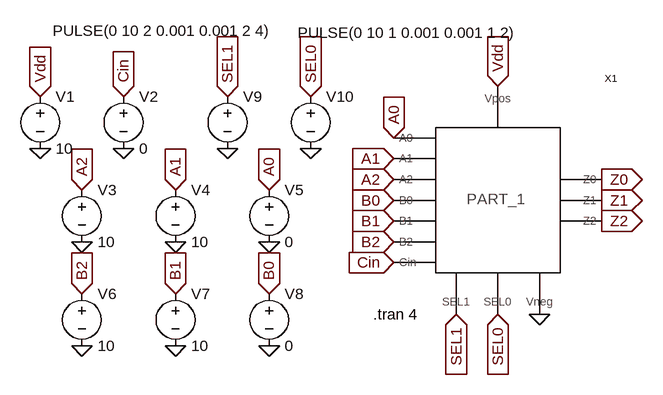
[diagram p0: schematic PART_1_SYM_TESTING.asc]
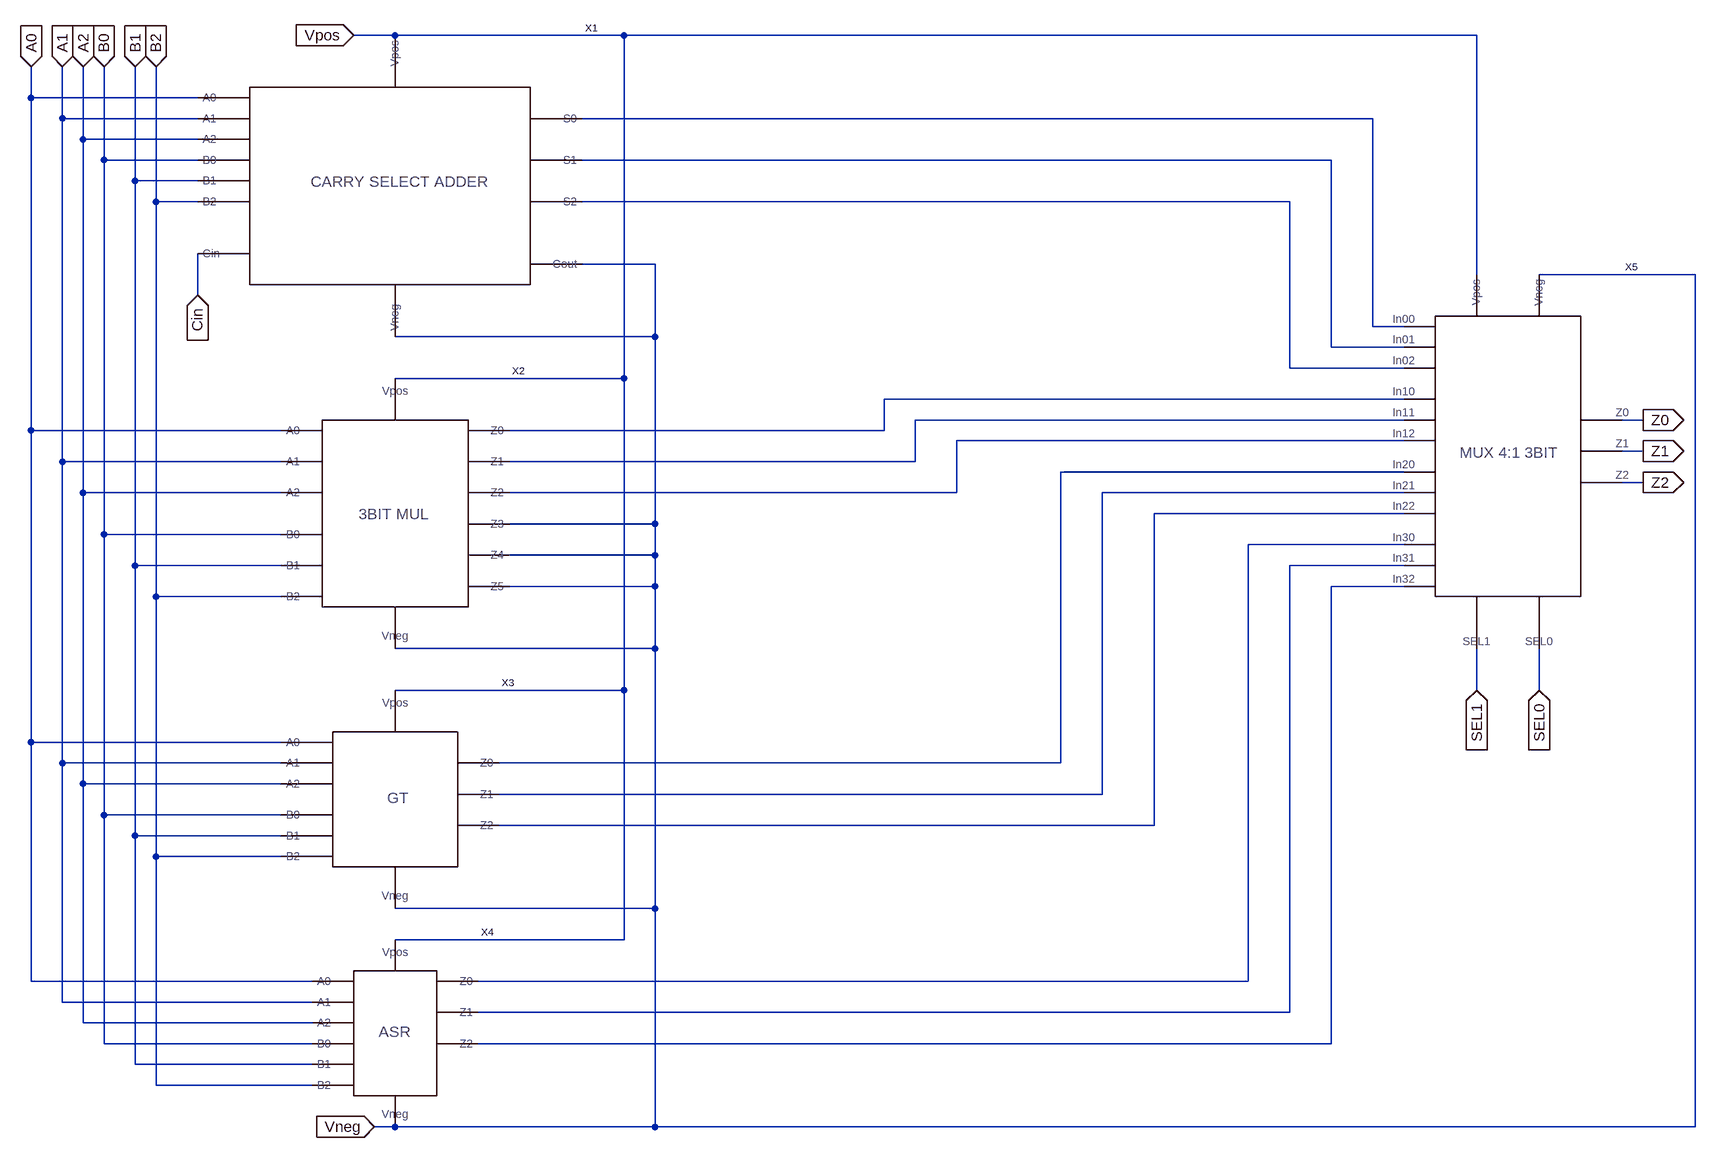
[diagram p1: sub-circuit part_1_sym.asc]
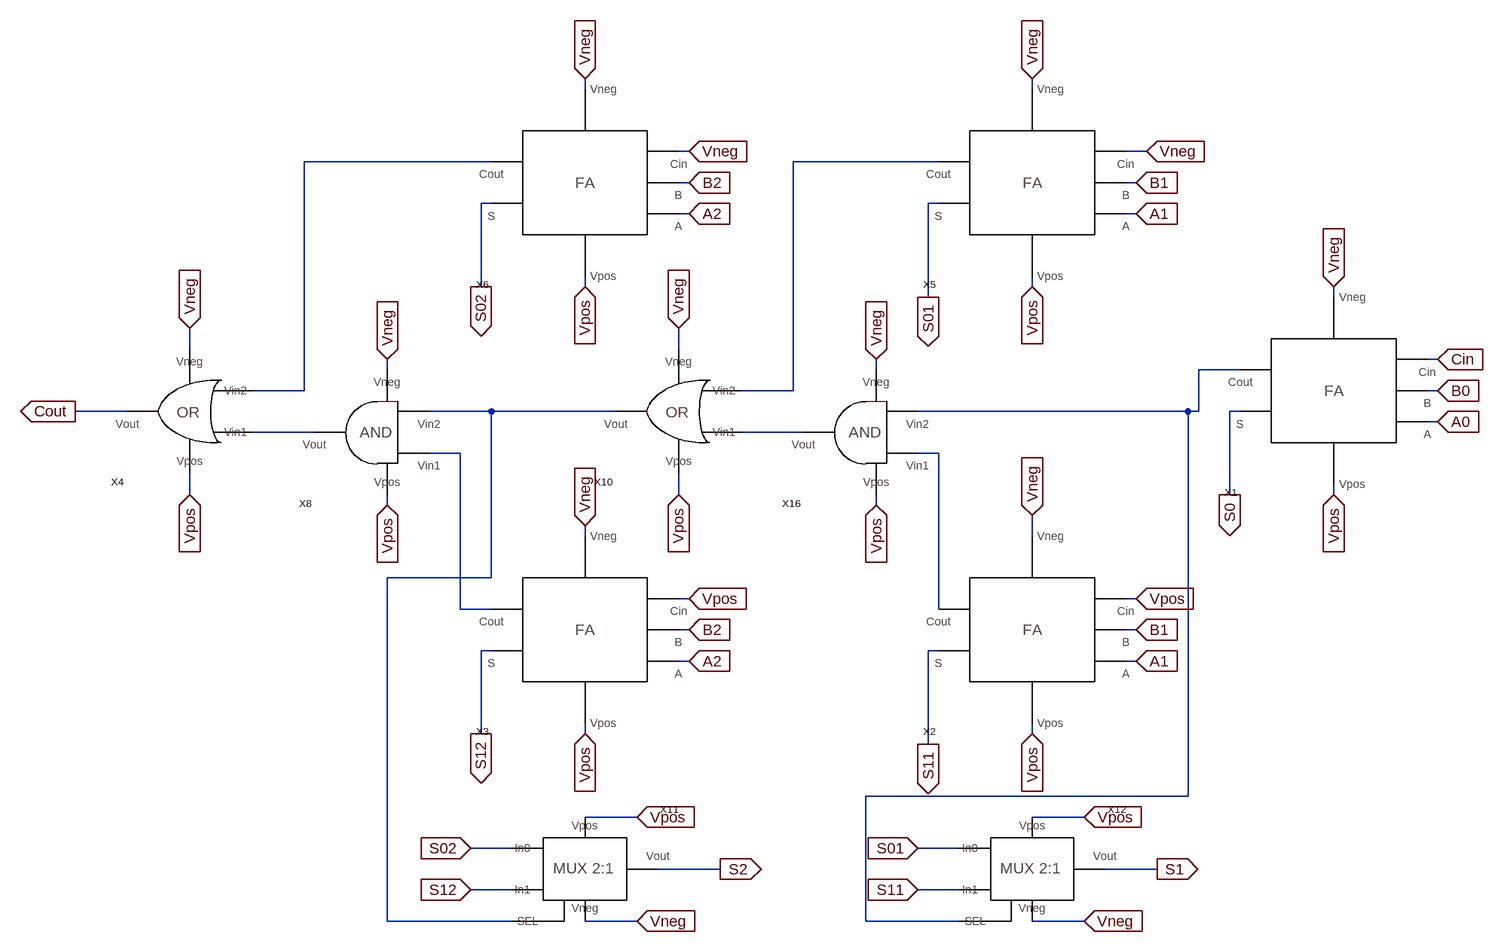
[diagram p2: sub-circuit carry_select_adder_sym.asc]
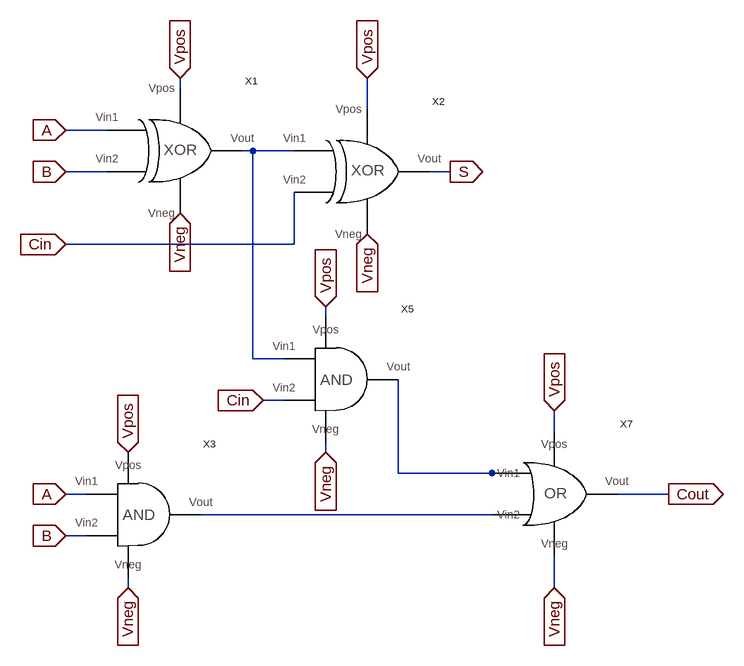
[diagram p3: sub-circuit full_adder_sym.asc]
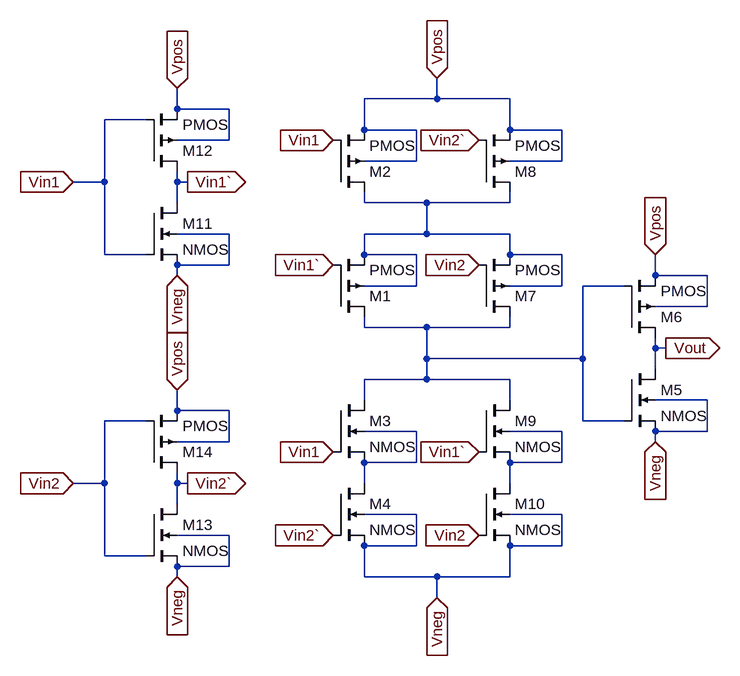
[diagram p4: sub-circuit xor_sym.asc]
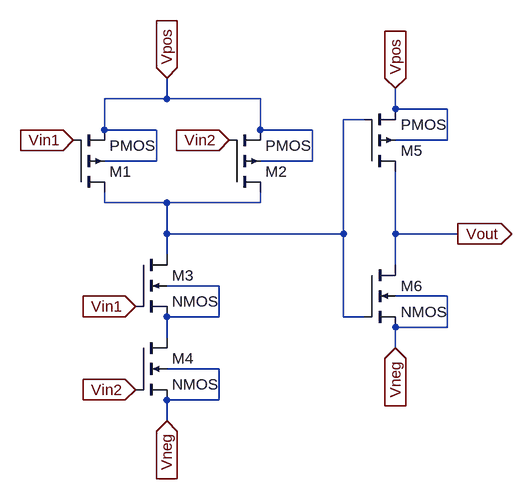
[diagram p5: sub-circuit and_sym.asc]
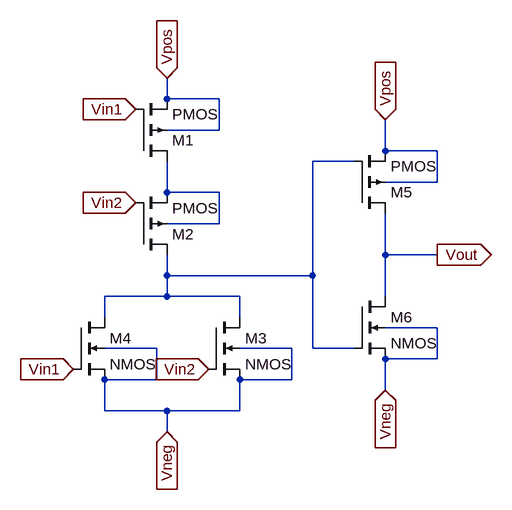
[diagram p6: sub-circuit or_sym.asc]
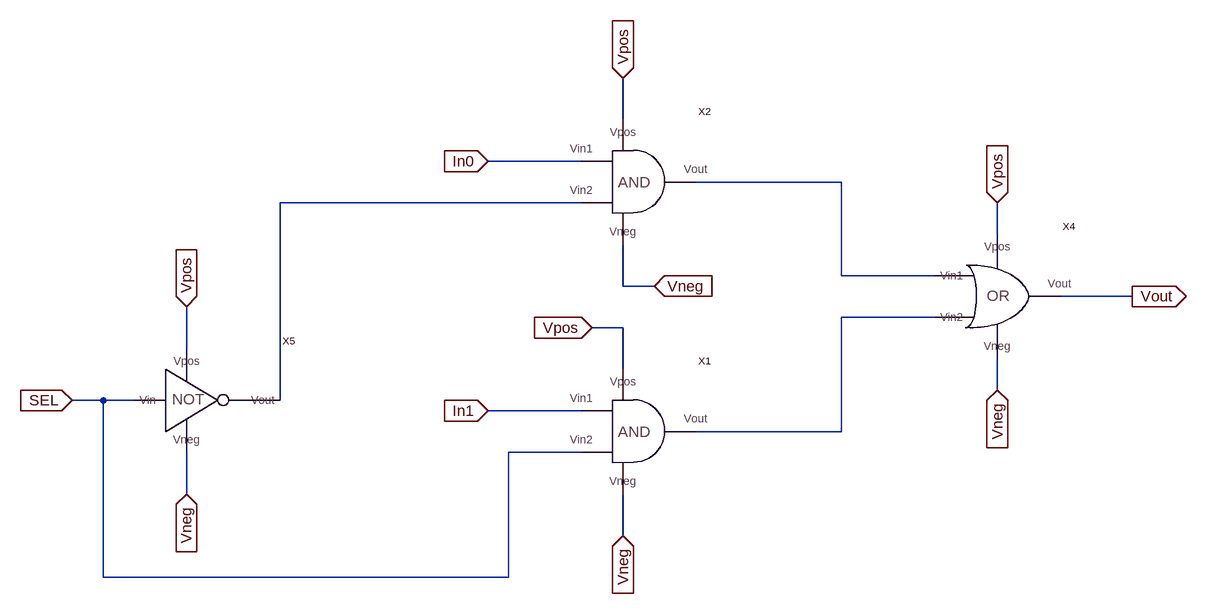
[diagram p7: sub-circuit mux2_1.asc]
PART_1_SYM_TESTING.asc, the LTspice schematic file:
Version 4
SHEET 1 880 680
FLAG -272 -496 0
FLAG -144 -496 0
FLAG 16 -496 0
FLAG 144 -496 0
FLAG -208 -352 0
FLAG -64 -352 0
FLAG 80 -352 0
FLAG -208 -192 0
FLAG -64 -192 0
FLAG 80 -192 0
FLAG 432 -592 Vdd
IOPIN 432 -592 In
FLAG 272 -512 A0
IOPIN 272 -512 In
FLAG 272 -480 A1
IOPIN 272 -480 In
FLAG 272 -448 A2
IOPIN 272 -448 In
FLAG 272 -416 B0
IOPIN 272 -416 In
FLAG 272 -384 B1
IOPIN 272 -384 In
FLAG 272 -352 B2
IOPIN 272 -352 In
FLAG 272 -320 Cin
IOPIN 272 -320 In
FLAG 368 -240 SEL1
IOPIN 368 -240 In
FLAG 432 -240 SEL0
IOPIN 432 -240 In
FLAG 496 -240 0
FLAG 592 -448 Z0
IOPIN 592 -448 Out
FLAG 592 -416 Z1
IOPIN 592 -416 Out
FLAG 592 -384 Z2
IOPIN 592 -384 Out
FLAG -272 -576 Vdd
IOPIN -272 -576 In
FLAG 80 -432 A0
IOPIN 80 -432 In
FLAG -64 -432 A1
IOPIN -64 -432 In
FLAG -208 -432 A2
IOPIN -208 -432 In
FLAG 80 -272 B0
IOPIN 80 -272 In
FLAG -64 -272 B1
IOPIN -64 -272 In
FLAG -208 -272 B2
IOPIN -208 -272 In
FLAG -144 -576 Cin
IOPIN -144 -576 In
FLAG 16 -576 SEL1
IOPIN 16 -576 In
FLAG 144 -576 SEL0
IOPIN 144 -576 In
SYMBOL PART_1_SYM 416 -384 R0
SYMATTR InstName X1
SYMBOL voltage -272 -592 R0
WINDOW 123 0 0 Left 0
WINDOW 39 0 0 Left 0
SYMATTR InstName V1
SYMATTR Value 10
SYMBOL voltage -144 -592 R0
WINDOW 123 0 0 Left 0
WINDOW 39 0 0 Left 0
SYMATTR InstName V2
SYMATTR Value 0
SYMBOL voltage -208 -448 R0
WINDOW 123 0 0 Left 0
WINDOW 39 0 0 Left 0
SYMATTR InstName V3
SYMATTR Value 10
SYMBOL voltage -64 -448 R0
WINDOW 123 0 0 Left 0
WINDOW 39 0 0 Left 0
SYMATTR InstName V4
SYMATTR Value 10
SYMBOL voltage 80 -448 R0
WINDOW 123 0 0 Left 0
WINDOW 39 0 0 Left 0
SYMATTR InstName V5
SYMATTR Value 0
SYMBOL voltage -208 -288 R0
WINDOW 123 0 0 Left 0
WINDOW 39 0 0 Left 0
SYMATTR InstName V6
SYMATTR Value 10
SYMBOL voltage -64 -288 R0
WINDOW 123 0 0 Left 0
WINDOW 39 0 0 Left 0
SYMATTR InstName V7
SYMATTR Value 10
SYMBOL voltage 80 -288 R0
WINDOW 123 0 0 Left 0
WINDOW 39 0 0 Left 0
SYMATTR InstName V8
SYMATTR Value 0
SYMBOL voltage 144 -592 R0
WINDOW 123 0 0 Left 0
WINDOW 39 0 0 Left 0
WINDOW 3 -20 -82 Left 2
SYMATTR InstName V10
SYMATTR Value PULSE(0 10 1 0.001 0.001 1 2)
SYMBOL voltage 16 -592 R0
WINDOW 123 0 0 Left 0
WINDOW 39 0 0 Left 0
WINDOW 3 -269 -85 Left 2
SYMATTR InstName V9
SYMATTR Value PULSE(0 10 2 0.001 0.001 2 4)
TEXT 240 -240 Left 2 !.tran 4

part_1_sym.asc, the sub-circuit schematic file:
Version 4
SHEET 1 2852 1416
WIRE 320 -336 256 -336
WIRE 672 -336 320 -336
WIRE 1984 -336 672 -336
WIRE -240 -240 -240 -288
WIRE 16 -240 -240 -240
WIRE -192 -208 -192 -288
WIRE 16 -208 -192 -208
WIRE 1824 -208 608 -208
WIRE -160 -176 -160 -288
WIRE 16 -176 -160 -176
WIRE -128 -144 -128 -288
WIRE 16 -144 -128 -144
WIRE 1760 -144 608 -144
WIRE -80 -112 -80 -288
WIRE 16 -112 -80 -112
WIRE -48 -80 -48 -288
WIRE 16 -80 -48 -80
WIRE 1696 -80 608 -80
WIRE 720 16 608 16
WIRE 1984 32 1984 -336
WIRE 2320 32 2080 32
WIRE 16 64 16 0
WIRE 1824 112 1824 -208
WIRE 1872 112 1824 112
WIRE 720 128 720 16
WIRE 720 128 320 128
WIRE 1760 144 1760 -144
WIRE 1872 144 1760 144
WIRE 1696 176 1696 -80
WIRE 1872 176 1696 176
WIRE 672 192 672 -336
WIRE 672 192 320 192
WIRE 1872 224 1072 224
WIRE 1872 256 1120 256
WIRE 2240 256 2208 256
WIRE -240 272 -240 -240
WIRE 144 272 -240 272
WIRE 1072 272 1072 224
WIRE 1072 272 496 272
WIRE 1872 288 1184 288
WIRE 2240 304 2208 304
WIRE -192 320 -192 -208
WIRE 144 320 -192 320
WIRE 1120 320 1120 256
WIRE 1120 320 496 320
WIRE 1872 336 1344 336
WIRE 2240 352 2208 352
WIRE -160 368 -160 -176
WIRE 144 368 -160 368
WIRE 1184 368 1184 288
WIRE 1184 368 496 368
WIRE 1872 368 1408 368
WIRE 1872 400 1488 400
WIRE 720 416 720 128
WIRE 720 416 496 416
WIRE -128 432 -128 -144
WIRE 144 432 -128 432
WIRE 1872 448 1632 448
WIRE 720 464 720 416
WIRE 720 464 496 464
WIRE -80 480 -80 -112
WIRE 144 480 -80 480
WIRE 1872 480 1696 480
WIRE 720 512 720 464
WIRE 720 512 496 512
WIRE 1872 512 1760 512
WIRE -48 528 -48 -80
WIRE 144 528 -48 528
WIRE 720 608 720 512
WIRE 720 608 320 608
WIRE 672 672 672 192
WIRE 672 672 320 672
WIRE 1984 672 1984 608
WIRE 2080 672 2080 608
WIRE -240 752 -240 272
WIRE 144 752 -240 752
WIRE -192 784 -192 320
WIRE 144 784 -192 784
WIRE 1344 784 1344 336
WIRE 1344 784 480 784
WIRE -160 816 -160 368
WIRE 144 816 -160 816
WIRE 1408 832 1408 368
WIRE 1408 832 480 832
WIRE -128 864 -128 432
WIRE 144 864 -128 864
WIRE 1488 880 1488 400
WIRE 1488 880 480 880
WIRE -80 896 -80 480
WIRE 144 896 -80 896
WIRE -48 928 -48 528
WIRE 144 928 -48 928
WIRE 720 1008 720 608
WIRE 720 1008 320 1008
WIRE 672 1056 672 672
WIRE 672 1056 320 1056
WIRE -240 1120 -240 752
WIRE 192 1120 -240 1120
WIRE 1632 1120 1632 448
WIRE 1632 1120 448 1120
WIRE -192 1152 -192 784
WIRE 192 1152 -192 1152
WIRE 1696 1168 1696 480
WIRE 1696 1168 448 1168
WIRE -160 1184 -160 816
WIRE 192 1184 -160 1184
WIRE -128 1216 -128 864
WIRE 192 1216 -128 1216
WIRE 1760 1216 1760 512
WIRE 1760 1216 448 1216
WIRE -80 1248 -80 896
WIRE 192 1248 -80 1248
WIRE -48 1280 -48 928
WIRE 192 1280 -48 1280
WIRE 320 1344 288 1344
WIRE 720 1344 720 1008
WIRE 720 1344 320 1344
WIRE 2320 1344 2320 32
WIRE 2320 1344 720 1344
FLAG 256 -336 Vpos
IOPIN 256 -336 In
FLAG -240 -288 A0
IOPIN -240 -288 In
FLAG -192 -288 A1
IOPIN -192 -288 In
FLAG -160 -288 A2
IOPIN -160 -288 In
FLAG -128 -288 B0
IOPIN -128 -288 In
FLAG -80 -288 B1
IOPIN -80 -288 In
FLAG -48 -288 B2
IOPIN -48 -288 In
FLAG 1984 672 SEL1
IOPIN 1984 672 In
FLAG 2080 672 SEL0
IOPIN 2080 672 In
FLAG 2240 256 Z0
IOPIN 2240 256 Out
FLAG 2240 304 Z1
IOPIN 2240 304 Out
FLAG 2240 352 Z2
IOPIN 2240 352 Out
FLAG 288 1344 Vneg
IOPIN 288 1344 In
FLAG 16 64 Cin
IOPIN 16 64 In
SYMBOL CARRY_SELECT_ADDER_SYM 320 -112 R0
SYMATTR InstName X1
SYMBOL MULTIPLIER_SYM 320 400 R0
SYMATTR InstName X2
SYMBOL GT_SYM 320 848 R0
SYMATTR InstName X3
SYMBOL ASR_SYMBOL 320 1200 R0
SYMATTR InstName X4
SYMBOL MUX3BIT_SYM 2032 224 R0
SYMATTR InstName X5

carry_select_adder_sym.asc, the sub-circuit schematic file:
Version 4
SHEET 1 1472 884
WIRE -400 -688 -400 -704
WIRE 288 -688 288 -704
WIRE -240 -592 -256 -592
WIRE 464 -592 432 -592
WIRE -544 -576 -832 -576
WIRE 144 -576 -80 -576
WIRE -240 -544 -256 -544
WIRE 448 -544 432 -544
WIRE -544 -512 -560 -512
WIRE 144 -512 128 -512
WIRE -240 -496 -256 -496
WIRE 448 -496 432 -496
WIRE -560 -384 -560 -512
WIRE -400 -384 -400 -400
WIRE 288 -384 288 -400
WIRE 128 -368 128 -512
WIRE 752 -368 752 -384
WIRE -1008 -288 -1008 -320
WIRE -256 -288 -256 -320
WIRE 912 -272 896 -272
WIRE -704 -256 -704 -272
WIRE 48 -256 48 -272
WIRE 608 -256 544 -256
WIRE -832 -224 -832 -576
WIRE -832 -224 -912 -224
WIRE -80 -224 -80 -576
WIRE -80 -224 -160 -224
WIRE 912 -224 896 -224
WIRE -1104 -192 -1184 -192
WIRE -544 -192 -640 -192
WIRE -352 -192 -544 -192
WIRE 528 -192 112 -192
WIRE 544 -192 544 -256
WIRE 544 -192 528 -192
WIRE 608 -192 592 -192
WIRE 912 -176 896 -176
WIRE -816 -160 -912 -160
WIRE -64 -160 -160 -160
WIRE -592 -128 -640 -128
WIRE 144 -128 112 -128
WIRE -1008 -64 -1008 -96
WIRE -256 -64 -256 -96
WIRE 592 -64 592 -192
WIRE 752 -64 752 -80
WIRE -704 -48 -704 -64
WIRE 48 -48 48 -64
WIRE -400 0 -400 -16
WIRE 288 0 288 -32
WIRE -544 64 -544 -192
WIRE -544 64 -704 64
WIRE -240 96 -256 96
WIRE 448 96 432 96
WIRE -592 112 -592 -128
WIRE -544 112 -592 112
WIRE 144 112 144 -128
WIRE -240 144 -256 144
WIRE 448 144 432 144
WIRE -544 176 -560 176
WIRE 144 176 128 176
WIRE -240 192 -256 192
WIRE 448 192 432 192
WIRE -560 304 -560 176
WIRE -400 304 -400 288
WIRE 288 304 288 288
WIRE 128 320 128 176
WIRE 528 400 528 -192
WIRE 528 400 32 400
WIRE -320 432 -400 432
WIRE 368 432 288 432
WIRE -512 480 -576 480
WIRE 176 480 112 480
WIRE -192 512 -288 512
WIRE 480 512 400 512
WIRE -512 544 -576 544
WIRE 176 544 112 544
WIRE -704 592 -704 64
WIRE -512 592 -704 592
WIRE -320 592 -400 592
WIRE 32 592 32 400
WIRE 176 592 32 592
WIRE 368 592 288 592
FLAG 912 -176 A0
IOPIN 912 -176 In
FLAG 448 192 A1
IOPIN 448 192 In
FLAG -240 192 A2
IOPIN -240 192 In
FLAG 912 -224 B0
IOPIN 912 -224 In
FLAG 448 144 B1
IOPIN 448 144 In
FLAG -240 144 B2
IOPIN -240 144 In
FLAG -400 304 Vpos
IOPIN -400 304 In
FLAG 288 304 Vpos
IOPIN 288 304 In
FLAG 752 -64 Vpos
IOPIN 752 -64 In
FLAG 592 -64 S0
IOPIN 592 -64 Out
FLAG 128 320 S11
IOPIN 128 320 Out
FLAG -560 304 S12
IOPIN -560 304 Out
FLAG 448 -496 A1
IOPIN 448 -496 In
FLAG -240 -496 A2
IOPIN -240 -496 In
FLAG 448 -544 B1
IOPIN 448 -544 In
FLAG -240 -544 B2
IOPIN -240 -544 In
FLAG 288 -384 Vpos
IOPIN 288 -384 In
FLAG 288 -704 Vneg
IOPIN 288 -704 In
FLAG -400 -704 Vneg
IOPIN -400 -704 In
FLAG 128 -368 S01
IOPIN 128 -368 Out
FLAG -560 -384 S02
IOPIN -560 -384 Out
FLAG -400 -384 Vpos
IOPIN -400 -384 In
FLAG 752 -384 Vneg
IOPIN 752 -384 In
FLAG 288 -32 Vneg
IOPIN 288 -32 In
FLAG -400 -16 Vneg
IOPIN -400 -16 In
FLAG -1008 -64 Vpos
IOPIN -1008 -64 In
FLAG -1008 -320 Vneg
IOPIN -1008 -320 In
FLAG -704 -48 Vpos
IOPIN -704 -48 In
FLAG -704 -272 Vneg
IOPIN -704 -272 In
FLAG -256 -320 Vneg
IOPIN -256 -320 In
FLAG 48 -272 Vneg
IOPIN 48 -272 In
FLAG -256 -64 Vpos
IOPIN -256 -64 In
FLAG 48 -48 Vpos
IOPIN 48 -48 In
FLAG -320 432 Vpos
IOPIN -320 432 In
FLAG 368 432 Vpos
IOPIN 368 432 In
FLAG -320 592 Vneg
IOPIN -320 592 In
FLAG 368 592 Vneg
IOPIN 368 592 In
FLAG -576 480 S02
IOPIN -576 480 In
FLAG -576 544 S12
IOPIN -576 544 In
FLAG 112 480 S01
IOPIN 112 480 In
FLAG 112 544 S11
IOPIN 112 544 In
FLAG -192 512 S2
IOPIN -192 512 Out
FLAG 480 512 S1
IOPIN 480 512 Out
FLAG -1184 -192 Cout
IOPIN -1184 -192 Out
FLAG 464 -592 Vneg
IOPIN 464 -592 In
FLAG -240 -592 Vneg
IOPIN -240 -592 In
FLAG -240 96 Vpos
IOPIN -240 96 In
FLAG 448 96 Vpos
IOPIN 448 96 In
FLAG 912 -272 Cin
IOPIN 912 -272 In
SYMBOL FULL_ADDER_SYM 752 -224 R180
SYMATTR InstName X1
SYMBOL FULL_ADDER_SYM 288 144 R180
SYMATTR InstName X2
SYMBOL FULL_ADDER_SYM -400 144 R180
SYMATTR InstName X3
SYMBOL FULL_ADDER_SYM 288 -544 R180
SYMATTR InstName X5
SYMBOL FULL_ADDER_SYM -400 -544 R180
SYMATTR InstName X6
SYMBOL OR_SYM -272 -192 R180
SYMATTR InstName X10
SYMBOL MUX2_1 -400 512 R0
SYMATTR InstName X11
SYMBOL MUX2_1 288 512 R0
SYMATTR InstName X12
SYMBOL AND_SYM 32 -160 R180
SYMATTR InstName X16
SYMBOL OR_SYM -1024 -192 R180
SYMATTR InstName X4
SYMBOL AND_SYM -720 -160 R180
SYMATTR InstName X8

full_adder_sym.asc, the sub-circuit schematic file:
Version 4
SHEET 1 1280 1092
WIRE 256 48 256 32
WIRE 544 80 544 32
WIRE 144 112 80 112
WIRE 368 144 352 144
WIRE 432 144 368 144
WIRE 144 176 80 176
WIRE 672 176 640 176
WIRE 432 288 432 208
WIRE 432 288 80 288
WIRE 480 400 480 384
WIRE 368 464 368 144
WIRE 416 464 368 464
WIRE 416 528 384 528
WIRE 832 576 832 544
WIRE 480 608 480 592
WIRE 176 624 176 608
WIRE 592 640 592 496
WIRE 736 640 592 640
WIRE 752 640 736 640
WIRE 112 672 80 672
WIRE 1008 672 928 672
WIRE 736 704 288 704
WIRE 112 736 80 736
WIRE 176 816 176 800
WIRE 832 816 832 768
FLAG 80 112 A
IOPIN 80 112 In
FLAG 80 176 B
IOPIN 80 176 In
FLAG 80 288 Cin
IOPIN 80 288 In
FLAG 256 32 Vpos
IOPIN 256 32 In
FLAG 256 240 Vneg
IOPIN 256 240 In
FLAG 544 32 Vpos
IOPIN 544 32 In
FLAG 544 272 Vneg
IOPIN 544 272 In
FLAG 80 672 A
IOPIN 80 672 In
FLAG 80 736 B
IOPIN 80 736 In
FLAG 384 528 Cin
IOPIN 384 528 In
FLAG 176 608 Vpos
IOPIN 176 608 In
FLAG 480 384 Vpos
IOPIN 480 384 In
FLAG 832 544 Vpos
IOPIN 832 544 In
FLAG 672 176 S
IOPIN 672 176 Out
FLAG 1008 672 Cout
IOPIN 1008 672 Out
FLAG 176 816 Vneg
IOPIN 176 816 In
FLAG 480 608 Vneg
IOPIN 480 608 In
FLAG 832 816 Vneg
IOPIN 832 816 In
SYMBOL XOR_SYM 256 144 R0
SYMATTR InstName X1
SYMBOL XOR_SYM 544 176 R0
SYMATTR InstName X2
SYMBOL AND_SYM 192 704 R0
SYMATTR InstName X3
SYMBOL AND_SYM 496 496 R0
SYMATTR InstName X5
SYMBOL OR_SYM 848 672 R0
SYMATTR InstName X7

xor_sym.asc, the sub-circuit schematic file:
Version 4
SHEET 1 880 772
WIRE 144 -144 144 -176
WIRE 144 -144 32 -144
WIRE 256 -144 144 -144
WIRE -256 -128 -256 -160
WIRE -176 -128 -256 -128
WIRE -304 -112 -368 -112
WIRE 32 -96 32 -144
WIRE 112 -96 32 -96
WIRE 256 -96 256 -144
WIRE 336 -96 256 -96
WIRE -176 -80 -176 -128
WIRE -176 -80 -256 -80
WIRE 112 -48 112 -96
WIRE 112 -48 32 -48
WIRE 336 -48 336 -96
WIRE 336 -48 256 -48
WIRE -368 -16 -368 -112
WIRE -368 -16 -416 -16
WIRE -256 -16 -256 -32
WIRE -240 -16 -256 -16
WIRE -256 16 -256 -16
WIRE 32 16 32 0
WIRE 128 16 32 16
WIRE 256 16 256 0
WIRE 256 16 128 16
WIRE -176 64 -256 64
WIRE 128 64 128 16
WIRE 128 64 32 64
WIRE 256 64 128 64
WIRE -368 96 -368 -16
WIRE -304 96 -368 96
WIRE 32 96 32 64
WIRE 112 96 32 96
WIRE 256 96 256 64
WIRE 336 96 256 96
WIRE -176 112 -176 64
WIRE -176 112 -256 112
WIRE -256 128 -256 112
WIRE 480 128 480 96
WIRE 560 128 480 128
WIRE 112 144 112 96
WIRE 112 144 32 144
WIRE 336 144 336 96
WIRE 336 144 256 144
WIRE 432 144 368 144
WIRE 560 176 560 128
WIRE 560 176 480 176
WIRE 32 208 32 192
WIRE 128 208 32 208
WIRE 256 208 256 192
WIRE 256 208 128 208
WIRE 480 240 480 224
WIRE 496 240 480 240
WIRE 128 256 128 208
WIRE 368 256 368 144
WIRE 368 256 128 256
WIRE 480 272 480 240
WIRE 128 288 128 256
WIRE 128 288 32 288
WIRE 256 288 128 288
WIRE 32 320 32 288
WIRE 256 320 256 288
WIRE 560 320 480 320
WIRE -256 336 -256 304
WIRE -176 336 -256 336
WIRE -304 352 -368 352
WIRE 368 352 368 256
WIRE 432 352 368 352
WIRE 112 368 32 368
WIRE 336 368 256 368
WIRE 560 368 560 320
WIRE 560 368 480 368
WIRE -176 384 -176 336
WIRE -176 384 -256 384
WIRE 480 384 480 368
WIRE 112 416 112 368
WIRE 112 416 32 416
WIRE 336 416 336 368
WIRE 336 416 256 416
WIRE -368 448 -368 352
WIRE -368 448 -416 448
WIRE -256 448 -256 432
WIRE -240 448 -256 448
WIRE 32 448 32 416
WIRE 256 448 256 416
WIRE -256 480 -256 448
WIRE 112 496 32 496
WIRE 336 496 256 496
WIRE -176 528 -256 528
WIRE 112 544 112 496
WIRE 112 544 32 544
WIRE 336 544 336 496
WIRE 336 544 256 544
WIRE -368 560 -368 448
WIRE -304 560 -368 560
WIRE -176 576 -176 528
WIRE -176 576 -256 576
WIRE -256 592 -256 576
WIRE 32 592 32 544
WIRE 144 592 32 592
WIRE 256 592 256 544
WIRE 256 592 144 592
WIRE 144 624 144 592
FLAG 144 -176 Vpos
IOPIN 144 -176 In
FLAG -416 -16 Vin1
IOPIN -416 -16 In
FLAG -16 400 Vin1
IOPIN -16 400 In
FLAG -416 448 Vin2
IOPIN -416 448 In
FLAG 144 624 Vneg
IOPIN 144 624 In
FLAG 480 96 Vpos
IOPIN 480 96 In
FLAG 480 384 Vneg
IOPIN 480 384 In
FLAG 496 240 Vout
IOPIN 496 240 Out
FLAG -16 -80 Vin1
IOPIN -16 -80 In
FLAG -256 -160 Vpos
IOPIN -256 -160 In
FLAG -256 128 Vneg
IOPIN -256 128 In
FLAG -240 -16 Vin1`
IOPIN -240 -16 Out
FLAG -256 304 Vpos
IOPIN -256 304 In
FLAG -256 592 Vneg
IOPIN -256 592 In
FLAG -240 448 Vin2`
IOPIN -240 448 Out
FLAG 208 112 Vin2
IOPIN 208 112 In
FLAG 208 -80 Vin2`
IOPIN 208 -80 In
FLAG -16 112 Vin1`
IOPIN -16 112 In
FLAG 208 400 Vin1`
IOPIN 208 400 In
FLAG -16 528 Vin2`
IOPIN -16 528 In
FLAG 208 528 Vin2
IOPIN 208 528 In
SYMBOL pmos4 -16 192 M180
SYMATTR InstName M1
SYMBOL pmos4 -16 0 M180
SYMATTR InstName M2
SYMBOL nmos4 -16 320 R0
SYMATTR InstName M3
SYMBOL nmos4 -16 448 R0
SYMATTR InstName M4
SYMBOL nmos4 432 272 R0
SYMATTR InstName M5
SYMBOL pmos4 432 224 M180
SYMATTR InstName M6
SYMBOL pmos4 208 192 M180
SYMATTR InstName M7
SYMBOL pmos4 208 0 M180
SYMATTR InstName M8
SYMBOL nmos4 208 320 R0
SYMATTR InstName M9
SYMBOL nmos4 208 448 R0
SYMATTR InstName M10
SYMBOL nmos4 -304 16 R0
SYMATTR InstName M11
SYMBOL pmos4 -304 -32 M180
SYMATTR InstName M12
SYMBOL nmos4 -304 480 R0
SYMATTR InstName M13
SYMBOL pmos4 -304 432 M180
SYMATTR InstName M14

and_sym.asc, the sub-circuit schematic file:
Version 4
SHEET 1 880 680
WIRE 272 -16 272 -48
WIRE 272 -16 176 -16
WIRE 416 -16 272 -16
WIRE 624 0 624 -32
WIRE 704 0 624 0
WIRE 576 16 544 16
WIRE 176 32 176 -16
WIRE 256 32 176 32
WIRE 416 32 416 -16
WIRE 496 32 416 32
WIRE 704 48 704 0
WIRE 704 48 624 48
WIRE 256 80 256 32
WIRE 256 80 176 80
WIRE 496 80 496 32
WIRE 496 80 416 80
WIRE 176 144 176 128
WIRE 272 144 176 144
WIRE 416 144 416 128
WIRE 416 144 272 144
WIRE 272 192 272 144
WIRE 544 192 544 16
WIRE 544 192 272 192
WIRE 624 192 624 96
WIRE 720 192 624 192
WIRE 272 224 272 192
WIRE 624 240 624 192
WIRE 352 272 272 272
WIRE 704 288 624 288
WIRE 352 320 352 272
WIRE 352 320 272 320
WIRE 544 320 544 192
WIRE 576 320 544 320
WIRE 704 336 704 288
WIRE 704 336 624 336
WIRE 272 352 272 320
WIRE 624 368 624 336
WIRE 352 400 272 400
WIRE 352 448 352 400
WIRE 352 448 272 448
WIRE 272 480 272 448
FLAG 272 -48 Vpos
IOPIN 272 -48 In
FLAG 128 48 Vin1
IOPIN 128 48 In
FLAG 224 304 Vin1
IOPIN 224 304 In
FLAG 224 432 Vin2
IOPIN 224 432 In
FLAG 720 192 Vout
IOPIN 720 192 Out
FLAG 368 48 Vin2
IOPIN 368 48 In
FLAG 272 480 Vneg
IOPIN 272 480 In
FLAG 624 -32 Vpos
IOPIN 624 -32 In
FLAG 624 368 Vneg
IOPIN 624 368 In
SYMBOL pmos4 128 128 M180
SYMATTR InstName M1
SYMBOL pmos4 368 128 M180
SYMATTR InstName M2
SYMBOL nmos4 224 224 R0
SYMATTR InstName M3
SYMBOL nmos4 224 352 R0
SYMATTR InstName M4
SYMBOL pmos4 576 96 M180
SYMATTR InstName M5
SYMBOL nmos4 576 240 R0
SYMATTR InstName M6

or_sym.asc, the sub-circuit schematic file:
Version 4
SHEET 1 880 680
WIRE 128 -128 128 -160
WIRE 208 -128 128 -128
WIRE 208 -80 208 -128
WIRE 208 -80 128 -80
WIRE 464 -48 464 -96
WIRE 544 -48 464 -48
WIRE 416 -32 352 -32
WIRE 544 0 544 -48
WIRE 544 0 464 0
WIRE 128 16 128 -32
WIRE 208 16 128 16
WIRE 208 64 208 16
WIRE 208 64 128 64
WIRE 464 112 464 48
WIRE 544 112 464 112
WIRE 128 144 128 112
WIRE 352 144 352 -32
WIRE 352 144 128 144
WIRE 128 176 128 144
WIRE 128 176 32 176
WIRE 240 176 128 176
WIRE 464 176 464 112
WIRE 32 208 32 176
WIRE 240 208 240 176
WIRE 544 224 464 224
WIRE 112 256 32 256
WIRE 320 256 240 256
WIRE 352 256 352 144
WIRE 416 256 352 256
WIRE 544 272 544 224
WIRE 544 272 464 272
WIRE 112 304 112 256
WIRE 112 304 32 304
WIRE 320 304 320 256
WIRE 320 304 240 304
WIRE 464 320 464 272
WIRE 32 352 32 304
WIRE 128 352 32 352
WIRE 240 352 240 304
WIRE 240 352 128 352
WIRE 128 384 128 352
FLAG 128 -160 Vpos
IOPIN 128 -160 In
FLAG 128 384 Vneg
IOPIN 128 384 In
FLAG -16 288 Vin1
IOPIN -16 288 In
FLAG 192 288 Vin2
IOPIN 192 288 In
FLAG 80 -112 Vin1
IOPIN 80 -112 In
FLAG 80 32 Vin2
IOPIN 80 32 In
FLAG 544 112 Vout
IOPIN 544 112 Out
FLAG 464 -96 Vpos
IOPIN 464 -96 In
FLAG 464 320 Vneg
IOPIN 464 320 In
SYMBOL pmos4 80 -32 M180
SYMATTR InstName M1
SYMBOL pmos4 80 112 M180
SYMATTR InstName M2
SYMBOL nmos4 192 208 R0
SYMATTR InstName M3
SYMBOL nmos4 -16 208 R0
SYMATTR InstName M4
SYMBOL pmos4 416 48 M180
SYMATTR InstName M5
SYMBOL nmos4 416 176 R0
SYMATTR InstName M6

mux2_1.asc, the sub-circuit schematic file:
Version 4
SHEET 1 1072 680
WIRE 176 -352 176 -416
WIRE 112 -288 -32 -288
WIRE 512 -256 288 -256
WIRE 112 -224 -352 -224
WIRE 752 -176 752 -224
WIRE 512 -112 512 -256
WIRE 656 -112 512 -112
WIRE 176 -96 176 -160
WIRE 224 -96 176 -96
WIRE 960 -80 848 -80
WIRE 656 -48 512 -48
WIRE 176 -32 128 -32
WIRE -496 0 -496 -64
WIRE 176 32 176 -32
WIRE 752 64 752 16
WIRE -624 80 -672 80
WIRE -576 80 -624 80
WIRE -352 80 -352 -224
WIRE 112 96 -32 96
WIRE 512 128 512 -48
WIRE 512 128 288 128
WIRE 112 160 0 160
WIRE -496 224 -496 160
WIRE 176 288 176 224
WIRE -624 352 -624 80
WIRE 0 352 0 160
WIRE 0 352 -624 352
FLAG -32 -288 In0
IOPIN -32 -288 In
FLAG -32 96 In1
IOPIN -32 96 In
FLAG -672 80 SEL
IOPIN -672 80 In
FLAG 176 -416 Vpos
IOPIN 176 -416 In
FLAG 224 -96 Vneg
IOPIN 224 -96 In
FLAG 128 -32 Vpos
IOPIN 128 -32 In
FLAG 752 -224 Vpos
IOPIN 752 -224 In
FLAG 752 64 Vneg
IOPIN 752 64 In
FLAG 176 288 Vneg
IOPIN 176 288 In
FLAG -496 -64 Vpos
IOPIN -496 -64 In
FLAG -496 224 Vneg
IOPIN -496 224 In
FLAG 960 -80 Vout
IOPIN 960 -80 Out
SYMBOL AND_SYM 192 128 R0
SYMATTR InstName X1
SYMBOL AND_SYM 192 -256 R0
SYMATTR InstName X2
SYMBOL OR_SYM 768 -80 R0
SYMATTR InstName X4
SYMBOL NOT_SYM -496 80 R0
SYMATTR InstName X5

multiplier_sym.asc, the sub-circuit schematic file:
Version 4
SHEET 1 2296 680
WIRE -1632 -1056 -1696 -1056
WIRE -1088 -1056 -1632 -1056
WIRE -384 -1056 -1088 -1056
WIRE 16 -1056 -384 -1056
WIRE 496 -1056 16 -1056
WIRE -1296 -992 -1360 -992
WIRE -1152 -992 -1296 -992
WIRE 832 -960 -976 -960
WIRE -1152 -928 -1168 -928
WIRE 832 -896 -96 -896
WIRE -1088 -864 -1568 -864
WIRE -384 -848 -384 -1056
WIRE 496 -832 496 -1056
WIRE -1632 -768 -1632 -1056
WIRE -1088 -768 -1632 -768
WIRE -688 -752 -880 -752
WIRE 192 -736 -32 -736
WIRE -688 -720 -832 -720
WIRE -96 -720 -96 -896
WIRE -1296 -704 -1296 -992
WIRE -1152 -704 -1296 -704
WIRE 192 -704 0 -704
WIRE 832 -704 784 -704
WIRE -880 -672 -880 -752
WIRE -880 -672 -976 -672
WIRE 192 -672 64 -672
WIRE -688 -656 -768 -656
WIRE -32 -656 -32 -736
WIRE -32 -656 -96 -656
WIRE -1152 -640 -1184 -640
WIRE 192 -640 96 -640
WIRE 832 -640 784 -640
WIRE -688 -624 -736 -624
WIRE 192 -608 128 -608
WIRE -688 -592 -704 -592
WIRE 0 -592 0 -704
WIRE 0 -592 -96 -592
WIRE -1568 -576 -1568 -864
WIRE -1088 -576 -1568 -576
WIRE 192 -576 160 -576
WIRE 832 -576 784 -576
WIRE 64 -496 64 -672
WIRE 64 -496 -96 -496
WIRE -1632 -480 -1632 -768
WIRE -1088 -480 -1632 -480
WIRE 832 -480 784 -480
WIRE -1152 -416 -1184 -416
WIRE -832 -384 -832 -720
WIRE -832 -384 -976 -384
WIRE -688 -384 -688 -512
WIRE -384 -384 -688 -384
WIRE -96 -384 -384 -384
WIRE -1296 -352 -1296 -704
WIRE -1152 -352 -1296 -352
WIRE -1568 -288 -1568 -576
WIRE -1088 -288 -1568 -288
WIRE -144 -256 -320 -256
WIRE 16 -256 16 -1056
WIRE 16 -256 -144 -256
WIRE -1632 -192 -1632 -480
WIRE -1088 -192 -1632 -192
WIRE -528 -192 -592 -192
WIRE -384 -192 -528 -192
WIRE 96 -160 96 -640
WIRE 96 -160 -208 -160
WIRE -1296 -128 -1360 -128
WIRE -1152 -128 -1296 -128
WIRE -384 -128 -400 -128
WIRE -768 -96 -768 -656
WIRE -768 -96 -976 -96
WIRE -1152 -64 -1168 -64
WIRE -96 -64 -96 -384
WIRE -96 -64 -320 -64
WIRE -1568 0 -1568 -288
WIRE -1088 0 -1568 0
WIRE -144 32 -144 -256
WIRE -144 32 -320 32
WIRE -1632 96 -1632 -192
WIRE -1088 96 -1632 96
WIRE -528 96 -528 -192
WIRE -384 96 -528 96
WIRE 128 128 128 -608
WIRE 128 128 -208 128
WIRE -1296 160 -1296 -128
WIRE -1152 160 -1296 160
WIRE -384 160 -416 160
WIRE -736 192 -736 -624
WIRE -736 192 -976 192
WIRE -1152 224 -1184 224
WIRE -96 224 -96 -64
WIRE -96 224 -320 224
WIRE -1568 288 -1568 0
WIRE -1088 288 -1568 288
WIRE -144 320 -144 32
WIRE -144 320 -320 320
WIRE -1632 384 -1632 96
WIRE -1088 384 -1632 384
WIRE -384 384 -416 384
WIRE 160 416 160 -576
WIRE 160 416 -208 416
WIRE -1152 448 -1184 448
WIRE -528 448 -528 96
WIRE -384 448 -528 448
WIRE -704 480 -704 -592
WIRE -704 480 -976 480
WIRE -1296 512 -1296 160
WIRE -1152 512 -1296 512
WIRE -1568 576 -1568 288
WIRE -1568 576 -1760 576
WIRE -1088 576 -1568 576
WIRE -320 576 -320 512
WIRE -320 576 -1088 576
WIRE -96 576 -96 224
WIRE -96 576 -320 576
WIRE 192 576 192 -496
WIRE 192 576 -96 576
WIRE 496 576 496 -368
WIRE 496 576 192 576
FLAG -1168 -928 A0
IOPIN -1168 -928 In
FLAG -1184 -640 A1
IOPIN -1184 -640 In
FLAG -1184 -416 A2
IOPIN -1184 -416 In
FLAG -1360 -992 B0
IOPIN -1360 -992 In
FLAG -1360 -128 B1
IOPIN -1360 -128 In
FLAG -688 -688 Vneg
IOPIN -688 -688 In
FLAG -1168 -64 A0
IOPIN -1168 -64 In
FLAG -1184 224 A1
IOPIN -1184 224 In
FLAG -1184 448 A2
IOPIN -1184 448 In
FLAG -592 -192 B2
IOPIN -592 -192 In
FLAG -400 -128 A0
IOPIN -400 -128 In
FLAG -416 160 A1
IOPIN -416 160 In
FLAG -416 384 A2
IOPIN -416 384 In
FLAG 832 -960 Z0
IOPIN 832 -960 Out
FLAG 832 -896 Z1
IOPIN 832 -896 Out
FLAG 832 -704 Z2
IOPIN 832 -704 Out
FLAG 832 -640 Z3
IOPIN 832 -640 Out
FLAG 832 -576 Z4
IOPIN 832 -576 Out
FLAG 832 -480 Z5
IOPIN 832 -480 Out
FLAG -1696 -1056 Vpos
IOPIN -1696 -1056 In
FLAG -1760 576 Vneg
IOPIN -1760 576 In
SYMBOL AND_SYM -1072 -960 R0
SYMATTR InstName X2
SYMBOL AND_SYM -1072 -672 R0
SYMATTR InstName X4
SYMBOL AND_SYM -1072 -384 R0
SYMATTR InstName X5
SYMBOL CARRY_SELECT_ADDER_SYM -384 -624 R0
SYMATTR InstName X1
SYMBOL CARRY_SELECT_ADDER_SYM 496 -608 R0
SYMATTR InstName X3
SYMBOL AND_SYM -1072 -96 R0
SYMATTR InstName X9
SYMBOL AND_SYM -1072 192 R0
SYMATTR InstName X10
SYMBOL AND_SYM -1072 480 R0
SYMATTR InstName X11
SYMBOL AND_SYM -304 -160 R0
SYMATTR InstName X12
SYMBOL AND_SYM -304 128 R0
SYMATTR InstName X13
SYMBOL AND_SYM -304 416 R0
SYMATTR InstName X14

gt_sym.asc, the sub-circuit schematic file:
Version 4
SHEET 1 3832 2184
WIRE -32 128 -96 128
WIRE 176 128 -32 128
WIRE 464 128 176 128
WIRE 688 128 464 128
WIRE 800 128 688 128
WIRE 1120 128 800 128
WIRE 1408 128 1120 128
WIRE 2480 128 1408 128
WIRE 176 176 176 128
WIRE -448 192 -448 128
WIRE 48 192 -448 192
WIRE -32 224 -32 128
WIRE 48 240 48 192
WIRE 112 240 48 240
WIRE 800 256 800 128
WIRE -256 304 -256 128
WIRE -112 304 -256 304
WIRE 288 320 288 272
WIRE 736 320 288 320
WIRE 976 352 912 352
WIRE 736 384 624 384
WIRE -32 416 -32 384
WIRE 176 416 176 368
WIRE 176 416 -32 416
WIRE 336 416 176 416
WIRE 1120 416 1120 128
WIRE -512 480 -512 128
WIRE 48 480 -512 480
WIRE 336 480 336 416
WIRE 800 480 800 448
WIRE 800 480 336 480
WIRE 976 480 976 352
WIRE 1024 480 976 480
WIRE 1280 512 1216 512
WIRE 176 544 -32 544
WIRE 464 544 464 128
WIRE 464 544 176 544
WIRE 1024 544 976 544
WIRE 1408 544 1408 128
WIRE 464 576 464 544
WIRE -32 592 -32 544
WIRE 48 608 48 480
WIRE 112 608 48 608
WIRE 1280 608 1280 512
WIRE 1312 608 1280 608
WIRE 400 640 288 640
WIRE 1568 640 1504 640
WIRE 2288 640 1568 640
WIRE -320 672 -320 128
WIRE -112 672 -320 672
WIRE 976 672 976 544
WIRE 976 672 576 672
WIRE 1312 672 1184 672
WIRE 800 752 800 480
WIRE 1120 752 1120 608
WIRE 1120 752 800 752
WIRE 1408 752 1408 736
WIRE 1408 752 1120 752
WIRE -32 768 -32 752
WIRE 176 768 176 736
WIRE 176 768 -32 768
WIRE 464 768 176 768
WIRE 800 768 800 752
WIRE 800 768 464 768
WIRE 3040 800 3008 800
WIRE 176 832 -32 832
WIRE 688 832 688 128
WIRE 688 832 176 832
WIRE -576 864 -576 128
WIRE 48 864 -576 864
WIRE 176 880 176 832
WIRE 2784 880 2576 880
WIRE -32 928 -32 832
WIRE 48 944 48 864
WIRE 112 944 48 944
WIRE 1184 976 1184 672
WIRE 1184 976 288 976
WIRE -384 1008 -384 128
WIRE -112 1008 -384 1008
WIRE 1744 1088 1056 1088
WIRE 2112 1088 1744 1088
WIRE -32 1120 -32 1088
WIRE 176 1120 176 1072
WIRE 176 1120 -32 1120
WIRE 800 1120 800 768
WIRE 800 1120 176 1120
WIRE 1568 1152 1568 640
WIRE 1632 1152 1568 1152
WIRE 1968 1184 1840 1184
WIRE 2480 1200 2480 128
WIRE 480 1216 160 1216
WIRE 688 1216 688 832
WIRE 688 1216 480 1216
WIRE 816 1216 688 1216
WIRE 1056 1216 1056 1088
WIRE 1056 1216 816 1216
WIRE 1072 1216 1056 1216
WIRE 1632 1216 1568 1216
WIRE 160 1248 160 1216
WIRE 3056 1248 3008 1248
WIRE 2288 1264 2288 640
WIRE 2384 1264 2288 1264
WIRE 2112 1280 2112 1088
WIRE 2576 1296 2576 880
WIRE -576 1312 -576 864
WIRE 48 1312 -576 1312
WIRE 2384 1328 2320 1328
WIRE 2576 1328 2576 1296
WIRE 2784 1328 2576 1328
WIRE 320 1344 256 1344
WIRE 400 1344 400 704
WIRE 400 1344 320 1344
WIRE 480 1344 480 1216
WIRE 1968 1344 1968 1184
WIRE 2000 1344 1968 1344
WIRE -384 1376 -384 1008
WIRE 48 1376 -384 1376
WIRE 816 1376 816 1216
WIRE 2320 1376 2320 1328
WIRE 2320 1376 2208 1376
WIRE 320 1408 320 1344
WIRE 416 1408 320 1408
WIRE 2000 1408 1968 1408
WIRE 624 1440 624 384
WIRE 624 1440 592 1440
WIRE 752 1440 624 1440
WIRE 416 1472 320 1472
WIRE 1568 1472 1568 1216
WIRE 1568 1472 928 1472
WIRE 1968 1472 1968 1408
WIRE 1968 1472 1568 1472
WIRE 160 1536 160 1440
WIRE 480 1536 160 1536
WIRE 640 1536 480 1536
WIRE 384 1568 160 1568
WIRE 640 1568 640 1536
WIRE 816 1568 640 1568
WIRE 1408 1568 1408 752
WIRE 1408 1568 816 1568
WIRE 1744 1568 1744 1280
WIRE 1744 1568 1408 1568
WIRE 2112 1568 2112 1472
WIRE 2112 1568 1744 1568
WIRE -512 1632 -512 480
WIRE 48 1632 -512 1632
WIRE 320 1664 320 1472
WIRE 320 1664 256 1664
WIRE -320 1696 -320 672
WIRE 48 1696 -320 1696
WIRE 3056 1696 3008 1696
WIRE 528 1760 160 1760
WIRE 2576 1776 2576 1328
WIRE 2784 1776 2576 1776
WIRE 384 1920 384 1568
WIRE 384 1920 160 1920
WIRE 1072 1920 1072 1216
WIRE 1072 1920 384 1920
WIRE -256 1984 -256 304
WIRE 48 1984 -256 1984
WIRE 752 2016 752 1504
WIRE 752 2016 256 2016
WIRE -448 2048 -448 192
WIRE 48 2048 -448 2048
WIRE 160 2112 96 2112
WIRE 528 2112 528 1760
WIRE 528 2112 160 2112
WIRE 1744 2112 1744 1568
WIRE 1744 2112 528 2112
WIRE 2480 2112 2480 1392
WIRE 2480 2112 1744 2112
FLAG -576 128 A2
IOPIN -576 128 In
FLAG -512 128 A1
IOPIN -512 128 In
FLAG -448 128 A0
IOPIN -448 128 In
FLAG -384 128 B2
IOPIN -384 128 In
FLAG -320 128 B1
IOPIN -320 128 In
FLAG -256 128 B0
IOPIN -256 128 In
FLAG 3040 800 Z0
IOPIN 3040 800 Out
FLAG 3056 1248 Z1
IOPIN 3056 1248 Out
FLAG 3056 1696 Z2
IOPIN 3056 1696 Out
FLAG 2896 720 Vpos
IOPIN 2896 720 In
FLAG 2784 1728 A2
IOPIN 2784 1728 In
FLAG 2784 1280 A1
IOPIN 2784 1280 In
FLAG 2784 832 A0
IOPIN 2784 832 In
FLAG 2896 1168 Vpos
IOPIN 2896 1168 In
FLAG 2896 1616 Vpos
IOPIN 2896 1616 In
FLAG 2896 880 Vneg
IOPIN 2896 880 In
FLAG 2896 1328 Vneg
IOPIN 2896 1328 In
FLAG 2896 1776 Vneg
IOPIN 2896 1776 In
FLAG 2784 768 Vpos
IOPIN 2784 768 In
FLAG 2784 1216 Vpos
IOPIN 2784 1216 In
FLAG 2784 1664 Vpos
IOPIN 2784 1664 In
FLAG -96 128 Vpos
IOPIN -96 128 In
FLAG 96 2112 Vneg
IOPIN 96 2112 In
SYMBOL MUX2_1 2896 800 R0
SYMATTR InstName X22
SYMBOL MUX2_1 2896 1248 R0
SYMATTR InstName X23
SYMBOL MUX2_1 2896 1696 R0
SYMATTR InstName X24
SYMBOL OR_SYM 2496 1296 R0
SYMATTR InstName X25
SYMBOL XNOR_SYM 160 1344 R0
SYMATTR InstName X1
SYMBOL AND_SYM 192 976 R0
SYMATTR InstName X2
SYMBOL NOT_SYM -32 1008 R0
SYMATTR InstName X3
SYMBOL AND_SYM 192 640 R0
SYMATTR InstName X4
SYMBOL NOT_SYM -32 672 R0
SYMATTR InstName X5
SYMBOL AND_SYM 192 272 R0
SYMATTR InstName X8
SYMBOL NOT_SYM -32 304 R0
SYMATTR InstName X9
SYMBOL XNOR_SYM 160 1664 R0
SYMATTR InstName X10
SYMBOL XNOR_SYM 160 2016 R0
SYMATTR InstName X11
SYMBOL AND_SYM 496 1440 R0
SYMATTR InstName X12
SYMBOL AND_SYM 816 352 R0
SYMATTR InstName X13
SYMBOL AND_SYM 832 1472 R0
SYMATTR InstName X14
SYMBOL OR_SYM 1136 512 R0
SYMATTR InstName X15
SYMBOL OR_SYM 1424 640 R0
SYMATTR InstName X16
SYMBOL AND_SYM 480 672 R0
SYMATTR InstName X17
SYMBOL XNOR_SYM 1744 1184 R0
SYMATTR InstName X6
SYMBOL XNOR_SYM 2112 1376 R0
SYMATTR InstName X7

xnor_sym.asc, the sub-circuit schematic file:
Version 4
SHEET 1 880 756
WIRE 384 -128 384 -160
WIRE 384 -128 272 -128
WIRE 496 -128 384 -128
WIRE -16 -112 -16 -144
WIRE 64 -112 -16 -112
WIRE -64 -96 -128 -96
WIRE 272 -80 272 -128
WIRE 352 -80 272 -80
WIRE 496 -80 496 -128
WIRE 576 -80 496 -80
WIRE 64 -64 64 -112
WIRE 64 -64 -16 -64
WIRE 352 -32 352 -80
WIRE 352 -32 272 -32
WIRE 576 -32 576 -80
WIRE 576 -32 496 -32
WIRE -128 0 -128 -96
WIRE -128 0 -176 0
WIRE -16 0 -16 -16
WIRE 0 0 -16 0
WIRE -16 32 -16 0
WIRE 272 32 272 16
WIRE 368 32 272 32
WIRE 496 32 496 16
WIRE 496 32 368 32
WIRE 64 80 -16 80
WIRE 368 80 368 32
WIRE 368 80 272 80
WIRE 496 80 368 80
WIRE -128 112 -128 0
WIRE -64 112 -128 112
WIRE 272 112 272 80
WIRE 352 112 272 112
WIRE 496 112 496 80
WIRE 576 112 496 112
WIRE 64 128 64 80
WIRE 64 128 -16 128
WIRE -16 144 -16 128
WIRE 352 160 352 112
WIRE 352 160 272 160
WIRE 576 160 576 112
WIRE 576 160 496 160
WIRE 272 224 272 208
WIRE 368 224 272 224
WIRE 496 224 496 208
WIRE 496 224 368 224
WIRE 368 272 368 224
WIRE 608 272 368 272
WIRE 368 304 368 272
WIRE 368 304 272 304
WIRE 496 304 368 304
WIRE 272 336 272 304
WIRE 496 336 496 304
WIRE -16 352 -16 320
WIRE 64 352 -16 352
WIRE -64 368 -128 368
WIRE 352 384 272 384
WIRE 576 384 496 384
WIRE 64 400 64 352
WIRE 64 400 -16 400
WIRE 352 432 352 384
WIRE 352 432 272 432
WIRE 576 432 576 384
WIRE 576 432 496 432
WIRE -128 464 -128 368
WIRE -128 464 -176 464
WIRE -16 464 -16 448
WIRE 0 464 -16 464
WIRE 272 464 272 432
WIRE 496 464 496 432
WIRE -16 496 -16 464
WIRE 352 512 272 512
WIRE 576 512 496 512
WIRE 64 544 -16 544
WIRE 352 560 352 512
WIRE 352 560 272 560
WIRE 576 560 576 512
WIRE 576 560 496 560
WIRE -128 576 -128 464
WIRE -64 576 -128 576
WIRE 64 592 64 544
WIRE 64 592 -16 592
WIRE -16 608 -16 592
WIRE 272 608 272 560
WIRE 384 608 272 608
WIRE 496 608 496 560
WIRE 496 608 384 608
WIRE 384 640 384 608
FLAG 384 -160 Vpos
IOPIN 384 -160 In
FLAG -176 0 Vin1
IOPIN -176 0 In
FLAG 224 416 Vin1
IOPIN 224 416 In
FLAG -176 464 Vin2
IOPIN -176 464 In
FLAG 384 640 Vneg
IOPIN 384 640 In
FLAG 608 272 Vout
IOPIN 608 272 Out
FLAG 224 -64 Vin1
IOPIN 224 -64 In
FLAG -16 -144 Vpos
IOPIN -16 -144 In
FLAG -16 144 Vneg
IOPIN -16 144 In
FLAG 0 0 Vin1`
IOPIN 0 0 Out
FLAG -16 320 Vpos
IOPIN -16 320 In
FLAG -16 608 Vneg
IOPIN -16 608 In
FLAG 0 464 Vin2`
IOPIN 0 464 Out
FLAG 448 128 Vin2
IOPIN 448 128 In
FLAG 448 -64 Vin2`
IOPIN 448 -64 In
FLAG 224 128 Vin1`
IOPIN 224 128 In
FLAG 448 416 Vin1`
IOPIN 448 416 In
FLAG 224 544 Vin2`
IOPIN 224 544 In
FLAG 448 544 Vin2
IOPIN 448 544 In
SYMBOL pmos4 224 208 M180
SYMATTR InstName M1
SYMBOL pmos4 224 16 M180
SYMATTR InstName M2
SYMBOL nmos4 224 336 R0
SYMATTR InstName M3
SYMBOL nmos4 224 464 R0
SYMATTR InstName M4
SYMBOL pmos4 448 208 M180
SYMATTR InstName M7
SYMBOL pmos4 448 16 M180
SYMATTR InstName M8
SYMBOL nmos4 448 336 R0
SYMATTR InstName M9
SYMBOL nmos4 448 464 R0
SYMATTR InstName M10
SYMBOL nmos4 -64 32 R0
SYMATTR InstName M11
SYMBOL pmos4 -64 -16 M180
SYMATTR InstName M12
SYMBOL nmos4 -64 496 R0
SYMATTR InstName M13
SYMBOL pmos4 -64 448 M180
SYMATTR InstName M14

asr_symbol.asc, the sub-circuit schematic file:
Version 4
SHEET 1 880 1324
FLAG 80 -112 A0
IOPIN 80 -112 In
FLAG 80 -80 A1
IOPIN 80 -80 In
FLAG 80 -48 A2
IOPIN 80 -48 In
FLAG 80 -16 A2
IOPIN 80 -16 In
FLAG 80 16 A2
IOPIN 80 16 In
FLAG 80 48 A2
IOPIN 80 48 In
FLAG 80 80 A2
IOPIN 80 80 In
FLAG 80 112 A2
IOPIN 80 112 In
FLAG -352 -80 A2
IOPIN -352 -80 In
FLAG -352 -48 A2
IOPIN -352 -48 In
FLAG -352 -16 A2
IOPIN -352 -16 In
FLAG -352 16 A2
IOPIN -352 16 In
FLAG -352 48 A2
IOPIN -352 48 In
FLAG -352 80 A2
IOPIN -352 80 In
FLAG -352 112 A2
IOPIN -352 112 In
FLAG -800 -112 A2
IOPIN -800 -112 In
FLAG -800 -80 A2
IOPIN -800 -80 In
FLAG -800 -48 A2
IOPIN -800 -48 In
FLAG -800 -16 A2
IOPIN -800 -16 In
FLAG -800 16 A2
IOPIN -800 16 In
FLAG -800 48 A2
IOPIN -800 48 In
FLAG -800 80 A2
IOPIN -800 80 In
FLAG -800 112 A2
IOPIN -800 112 In
FLAG -224 -176 Vpos
IOPIN -224 -176 In
FLAG -160 -176 Vneg
IOPIN -160 -176 In
FLAG 304 176 B0
IOPIN 304 176 In
FLAG 240 176 B1
IOPIN 240 176 In
FLAG 176 176 B2
IOPIN 176 176 In
FLAG -128 176 B0
IOPIN -128 176 In
FLAG -576 176 B0
IOPIN -576 176 In
FLAG -192 176 B1
IOPIN -192 176 In
FLAG -256 176 B2
IOPIN -256 176 In
FLAG -640 176 B1
IOPIN -640 176 In
FLAG -704 176 B2
IOPIN -704 176 In
FLAG -672 -176 Vpos
IOPIN -672 -176 In
FLAG -608 -176 Vneg
IOPIN -608 -176 In
FLAG 208 -176 Vpos
IOPIN 208 -176 In
FLAG 272 -176 Vneg
IOPIN 272 -176 In
FLAG 400 0 Z0
IOPIN 400 0 Out
FLAG -32 0 Z1
IOPIN -32 0 Out
FLAG -480 0 Z2
IOPIN -480 0 Out
FLAG -352 -112 A1
IOPIN -352 -112 In
SYMBOL MUX_8_1_SYMBOL 240 0 R0
SYMATTR InstName X1
SYMBOL MUX_8_1_SYMBOL -192 0 R0
SYMATTR InstName X2
SYMBOL MUX_8_1_SYMBOL -640 0 R0
SYMATTR InstName X3

mux_8_1_symbol.asc, the sub-circuit schematic file:
Version 4
SHEET 1 1296 708
WIRE 256 -416 256 -432
WIRE 64 -352 0 -352
WIRE 64 -320 0 -320
WIRE 64 -288 0 -288
WIRE 672 -272 448 -272
WIRE 64 -256 0 -256
WIRE 64 -224 0 -224
WIRE 64 -192 0 -192
WIRE 256 -112 256 -128
WIRE 992 -96 992 -144
WIRE 672 -48 672 -272
WIRE 880 -48 672 -48
WIRE 1184 -16 1104 -16
WIRE 880 16 672 16
WIRE 992 112 992 64
WIRE 880 144 880 64
WIRE 256 160 256 144
WIRE 64 224 0 224
WIRE 64 256 0 256
WIRE 64 288 0 288
WIRE 672 304 672 16
WIRE 672 304 448 304
WIRE 64 320 0 320
WIRE 64 352 0 352
WIRE 64 384 0 384
WIRE 256 464 256 448
FLAG 0 -352 In0
IOPIN 0 -352 In
FLAG 0 -320 In1
IOPIN 0 -320 In
FLAG 0 -288 In2
IOPIN 0 -288 In
FLAG 0 -256 In3
IOPIN 0 -256 In
FLAG 0 -224 SEL1
IOPIN 0 -224 In
FLAG 0 -192 SEL0
IOPIN 0 -192 In
FLAG 0 224 In4
IOPIN 0 224 In
FLAG 0 256 In5
IOPIN 0 256 In
FLAG 0 288 In6
IOPIN 0 288 In
FLAG 0 320 In7
IOPIN 0 320 In
FLAG 0 352 SEL1
IOPIN 0 352 In
FLAG 0 384 SEL0
IOPIN 0 384 In
FLAG 256 144 Vpos
IOPIN 256 144 In
FLAG 256 -432 Vpos
IOPIN 256 -432 In
FLAG 256 -112 Vneg
IOPIN 256 -112 In
FLAG 256 464 Vneg
IOPIN 256 464 In
FLAG 880 144 SEL2
IOPIN 880 144 In
FLAG 992 112 Vneg
IOPIN 992 112 In
FLAG 992 -144 Vpos
IOPIN 992 -144 In
FLAG 1184 -16 Vout
IOPIN 1184 -16 Out
SYMBOL MUX4_1_SYM 256 -272 R0
SYMATTR InstName X1
SYMBOL MUX4_1_SYM 256 304 R0
SYMATTR InstName X2
SYMBOL MUX2_1 992 -16 R0
SYMATTR InstName X3

mux4_1_sym.asc, the sub-circuit schematic file:
Version 4
SHEET 1 880 680
WIRE 16 -112 16 -160
WIRE -96 -64 -208 -64
WIRE 256 -32 128 -32
WIRE -96 0 -208 0
WIRE 464 16 464 -32
WIRE -96 48 -208 48
WIRE 256 64 256 -32
WIRE 352 64 256 64
WIRE 16 96 16 48
WIRE 64 96 16 96
WIRE 656 96 576 96
WIRE 352 128 256 128
WIRE 16 192 -32 192
WIRE 16 240 16 192
WIRE 352 240 352 176
WIRE 464 240 464 176
WIRE -96 288 -208 288
WIRE 256 320 256 128
WIRE 256 320 128 320
WIRE -96 352 -208 352
WIRE -96 400 -208 400
WIRE 16 448 16 400
FLAG 16 -160 Vpos
IOPIN 16 -160 In
FLAG -32 192 Vpos
IOPIN -32 192 In
FLAG 464 -32 Vpos
IOPIN 464 -32 In
FLAG -208 -64 In0
IOPIN -208 -64 In
FLAG -208 0 In1
IOPIN -208 0 In
FLAG -208 288 In2
IOPIN -208 288 In
FLAG -208 352 In3
IOPIN -208 352 In
FLAG 352 240 SEL1
IOPIN 352 240 In
FLAG -208 48 SEL0
IOPIN -208 48 In
FLAG 656 96 Vout
IOPIN 656 96 Out
FLAG -208 400 SEL0
IOPIN -208 400 In
FLAG 464 240 Vneg
IOPIN 464 240 In
FLAG 16 448 Vneg
IOPIN 16 448 In
FLAG 64 96 Vneg
IOPIN 64 96 In
SYMBOL MUX2_1 16 -32 R0
SYMATTR InstName X1
SYMBOL MUX2_1 464 96 R0
SYMATTR InstName X2
SYMBOL MUX2_1 16 320 R0
SYMATTR InstName X3

mux3bit_sym.asc, the sub-circuit schematic file:
Version 4
SHEET 1 880 1012
WIRE -256 -128 -256 -160
WIRE 256 -128 -256 -128
WIRE 64 -64 0 -64
WIRE 64 -32 0 -32
WIRE 64 0 0 0
WIRE 480 16 448 16
WIRE 64 32 0 32
WIRE 64 64 0 64
WIRE 64 96 0 96
WIRE 256 160 -192 160
WIRE -256 240 -256 -128
WIRE 256 240 -256 240
WIRE 64 304 0 304
WIRE 64 336 0 336
WIRE 64 368 0 368
WIRE 480 384 448 384
WIRE 64 400 0 400
WIRE 64 432 0 432
WIRE 64 464 0 464
WIRE -192 528 -192 160
WIRE 256 528 -192 528
WIRE -256 576 -256 240
WIRE 256 576 -256 576
WIRE 64 640 0 640
WIRE 64 672 0 672
WIRE 64 704 0 704
WIRE 480 720 448 720
WIRE 64 736 0 736
WIRE 64 768 0 768
WIRE 64 800 0 800
WIRE -192 864 -192 528
WIRE 256 864 -192 864
WIRE -192 896 -192 864
FLAG 0 -64 In00
IOPIN 0 -64 In
FLAG 0 -32 In10
IOPIN 0 -32 In
FLAG 0 0 In20
IOPIN 0 0 In
FLAG 0 32 In30
IOPIN 0 32 In
FLAG 0 64 SEL1
IOPIN 0 64 In
FLAG 0 96 SEL0
IOPIN 0 96 In
FLAG 0 304 In01
IOPIN 0 304 In
FLAG 0 336 In11
IOPIN 0 336 In
FLAG 0 368 In21
IOPIN 0 368 In
FLAG 0 400 In31
IOPIN 0 400 In
FLAG 0 432 SEL1
IOPIN 0 432 In
FLAG 0 464 SEL0
IOPIN 0 464 In
FLAG 0 640 In02
IOPIN 0 640 In
FLAG 0 672 In12
IOPIN 0 672 In
FLAG 0 704 In22
IOPIN 0 704 In
FLAG 0 736 In32
IOPIN 0 736 In
FLAG 0 768 SEL1
IOPIN 0 768 In
FLAG 0 800 SEL0
IOPIN 0 800 In
FLAG -256 -160 Vpos
IOPIN -256 -160 In
FLAG 480 16 Z0
IOPIN 480 16 Out
FLAG 480 384 Z1
IOPIN 480 384 Out
FLAG 480 720 Z2
IOPIN 480 720 Out
FLAG -192 896 Vneg
IOPIN -192 896 In
SYMBOL MUX4_1_SYM 256 16 R0
SYMATTR InstName X1
SYMBOL MUX4_1_SYM 256 384 R0
SYMATTR InstName X2
SYMBOL MUX4_1_SYM 256 720 R0
SYMATTR InstName X3

The netlist it stands for:
* PART_1_SYM_TESTING.asc
XX1 A0 A1 A2 B0 B1 B2 Cin Vdd SEL0 Z0 Z1 Z2 0 SEL1 part_1_sym
V1 Vdd 0 10
V2 Cin 0 0
V3 A2 0 10
V4 A1 0 10
V5 A0 0 0
V6 B2 0 10
V7 B1 0 10
V8 B0 0 0
V10 SEL0 0 PULSE(0 10 1 0.001 0.001 1 2)
V9 SEL1 0 PULSE(0 10 2 0.001 0.001 2 4)

* block symbol definitions
.subckt part_1_sym A0 A1 A2 B0 B1 B2 Cin Vpos SEL0 Z0 Z1 Z2 Vneg SEL1
XX1 A0 A1 A2 B0 B1 B2 Vneg Vpos Vneg N001 N002 N003 Cin carry_select_adder_sym
XX2 A0 A1 A2 B0 B1 B2 Vpos Vneg N004 N005 N006 Vneg Vneg Vneg multiplier_sym
XX3 A0 A1 A2 B0 B1 B2 N007 N008 N009 Vpos Vneg gt_sym
XX4 A0 A1 A2 B0 B1 B2 N010 N011 N012 Vpos Vneg asr_symbol
XX5 Vpos Vneg N001 N002 N003 N004 N005 N006 N007 N008 N009 N010 N011 N012 Z0 Z1 Z2 SEL0 SEL1 mux3bit_sym
.ends part_1_sym

.subckt carry_select_adder_sym A0 A1 A2 B0 B1 B2 Cout Vpos Vneg S0 S1 S2 Cin
XX1 A0 B0 Cin S0 N003 Vpos Vneg full_adder_sym
XX2 A1 B1 Vpos S11 N008 Vpos Vneg full_adder_sym
XX3 A2 B2 Vpos S12 N007 Vpos Vneg full_adder_sym
XX5 A1 B1 Vneg S01 N002 Vpos Vneg full_adder_sym
XX6 A2 B2 Vneg S02 N001 Vpos Vneg full_adder_sym
XX10 Vpos N006 N002 N004 Vneg or_sym
XX11 S02 S12 N004 Vpos Vneg S2 mux2_1
XX12 S01 S11 N003 Vpos Vneg S1 mux2_1
XX16 N008 N003 Vpos Vneg N006 and_sym
XX4 Vpos N005 N001 Cout Vneg or_sym
XX8 N007 N004 Vpos Vneg N005 and_sym
.ends carry_select_adder_sym

.subckt full_adder_sym A B Cin S Cout Vpos Vneg
XX1 A B Vpos N001 Vneg xor_sym
XX2 N001 Cin Vpos S Vneg xor_sym
XX3 A B Vpos Vneg N003 and_sym
XX5 N001 Cin Vpos Vneg N002 and_sym
XX7 Vpos N002 N003 Cout Vneg or_sym
.ends full_adder_sym

.subckt xor_sym Vin1 Vin2 Vpos Vout Vneg
M1 N002 Vin1` N001 N001 PMOS
M2 N001 Vin1 Vpos Vpos PMOS
M3 N002 Vin1 N003 N003 NMOS
M4 N003 Vin2` Vneg Vneg NMOS
M5 Vout N002 Vneg Vneg NMOS
M6 Vout N002 Vpos Vpos PMOS
M7 N002 Vin2 N001 N001 PMOS
M8 N001 Vin2` Vpos Vpos PMOS
M9 N002 Vin1` N004 N004 NMOS
M10 N004 Vin2 Vneg Vneg NMOS
M11 Vin1` Vin1 Vneg Vneg NMOS
M12 Vin1` Vin1 Vpos Vpos PMOS
M13 Vin2` Vin2 Vneg Vneg NMOS
M14 Vin2` Vin2 Vpos Vpos PMOS
.ends xor_sym

.subckt and_sym Vin1 Vin2 Vpos Vneg Vout
M1 N001 Vin1 Vpos Vpos PMOS
M2 N001 Vin2 Vpos Vpos PMOS
M3 N001 Vin1 N002 N002 NMOS
M4 N002 Vin2 Vneg Vneg NMOS
M5 Vout N001 Vpos Vpos PMOS
M6 Vout N001 Vneg Vneg NMOS
.ends and_sym

.subckt or_sym Vpos Vin1 Vin2 Vout Vneg
M1 N002 Vin1 Vpos Vpos PMOS
M2 N001 Vin2 N002 N002 PMOS
M3 N001 Vin2 Vneg Vneg NMOS
M4 N001 Vin1 Vneg Vneg NMOS
M5 Vout N001 Vpos Vpos PMOS
M6 Vout N001 Vneg Vneg NMOS
.ends or_sym

.subckt mux2_1 In0 In1 SEL Vpos Vneg Vout
XX1 In1 SEL Vpos Vneg N003 and_sym
XX2 In0 N002 Vpos Vneg N001 and_sym
XX4 Vpos N001 N003 Vout Vneg or_sym
XX5 SEL Vpos N002 Vneg NOT_SYM  ; pins Vin Vpos Vout Vneg
.ends mux2_1

.subckt multiplier_sym A0 A1 A2 B0 B1 B2 Vpos Vneg Z0 Z1 Z2 Z3 Z4 Z5
XX2 B0 A0 Vpos Vneg Z0 and_sym
XX4 B0 A1 Vpos Vneg N001 and_sym
XX5 A2 B0 Vpos Vneg N003 and_sym
XX1 N001 N003 Vneg N006 N008 N010 N005 Vpos Vneg Z1 N002 N004 Vneg carry_select_adder_sym
XX3 N002 N004 N005 N007 N009 N011 Z5 Vpos Vneg Z2 Z3 Z4 Vneg carry_select_adder_sym
XX9 B1 A0 Vpos Vneg N006 and_sym
XX10 B1 A1 Vpos Vneg N008 and_sym
XX11 A2 B1 Vpos Vneg N010 and_sym
XX12 B2 A0 Vpos Vneg N007 and_sym
XX13 B2 A1 Vpos Vneg N009 and_sym
XX14 A2 B2 Vpos Vneg N011 and_sym
.ends multiplier_sym

.subckt gt_sym A0 A1 A2 B0 B1 B2 Z0 Z1 Z2 Vpos Vneg
XX22 Vpos A0 N009 Vpos Vneg Z0 mux2_1
XX23 Vpos A1 N009 Vpos Vneg Z1 mux2_1
XX24 Vpos A2 N009 Vpos Vneg Z2 mux2_1
XX25 Vpos N007 N012 N009 Vneg or_sym
XX1 A2 B2 Vpos N013 Vneg xnor_sym
XX2 A2 P001 Vpos Vneg N008 and_sym
XX3 B2 Vpos P001 Vneg NOT_SYM  ; pins Vin Vpos Vout Vneg
XX4 A1 P002 Vpos Vneg N006 and_sym
XX5 B1 Vpos P002 Vneg NOT_SYM  ; pins Vin Vpos Vout Vneg
XX8 A0 P003 Vpos Vneg N001 and_sym
XX9 B0 Vpos P003 Vneg NOT_SYM  ; pins Vin Vpos Vout Vneg
XX10 A1 B1 Vpos N014 Vneg xnor_sym
XX11 B0 A0 Vpos N015 Vneg xnor_sym
XX12 N013 N014 Vpos Vneg N003 and_sym
XX13 N001 N003 Vpos Vneg N002 and_sym
XX14 N003 N015 Vpos Vneg N011 and_sym
XX15 Vpos N002 N005 N004 Vneg or_sym
XX16 Vpos N004 N008 N007 Vneg or_sym
XX17 N006 N013 Vpos Vneg N005 and_sym
XX6 N007 N011 Vpos N010 Vneg xnor_sym
XX7 N010 N011 Vpos N012 Vneg xnor_sym
.ends gt_sym

.subckt xnor_sym Vin1 Vin2 Vpos Vout Vneg
M1 Vout Vin1` N001 N001 PMOS
M2 N001 Vin1 Vpos Vpos PMOS
M3 Vout Vin1 N002 N002 NMOS
M4 N002 Vin2` Vneg Vneg NMOS
M7 Vout Vin2 N001 N001 PMOS
M8 N001 Vin2` Vpos Vpos PMOS
M9 Vout Vin1` N003 N003 NMOS
M10 N003 Vin2 Vneg Vneg NMOS
M11 Vin1` Vin1 Vneg Vneg NMOS
M12 Vin1` Vin1 Vpos Vpos PMOS
M13 Vin2` Vin2 Vneg Vneg NMOS
M14 Vin2` Vin2 Vpos Vpos PMOS
.ends xnor_sym

.subckt asr_symbol A0 A1 A2 B0 B1 B2 Z0 Z1 Z2 Vpos Vneg
XX1 Vpos A0 A1 A2 A2 A2 A2 A2 A2 B1 B2 B0 Z0 Vneg mux_8_1_symbol
XX2 Vpos A1 A2 A2 A2 A2 A2 A2 A2 B1 B2 B0 Z1 Vneg mux_8_1_symbol
XX3 Vpos A2 A2 A2 A2 A2 A2 A2 A2 B1 B2 B0 Z2 Vneg mux_8_1_symbol
.ends asr_symbol

.subckt mux_8_1_symbol Vpos In0 In1 In2 In3 In4 In5 In6 In7 SEL1 SEL2 SEL0 Vout Vneg
XX1 N001 Vpos Vneg In0 In1 In2 In3 SEL1 SEL0 mux4_1_sym
XX2 N002 Vpos Vneg In4 In5 In6 In7 SEL1 SEL0 mux4_1_sym
XX3 N001 N002 SEL2 Vpos Vneg Vout mux2_1
.ends mux_8_1_symbol

.subckt mux4_1_sym Vout Vpos Vneg In0 In1 In2 In3 SEL1 SEL0
XX1 In0 In1 SEL0 Vpos Vneg N001 mux2_1
XX2 N001 N002 SEL1 Vpos Vneg Vout mux2_1
XX3 In2 In3 SEL0 Vpos Vneg N002 mux2_1
.ends mux4_1_sym

.subckt mux3bit_sym Vpos Vneg In00 In01 In02 In10 In11 In12 In20 In21 In22 In30 In31 In32 Z0 Z1 Z2 SEL0 SEL1
XX1 Z0 Vpos Vneg In00 In10 In20 In30 SEL1 SEL0 mux4_1_sym
XX2 Z1 Vpos Vneg In01 In11 In21 In31 SEL1 SEL0 mux4_1_sym
XX3 Z2 Vpos Vneg In02 In12 In22 In32 SEL1 SEL0 mux4_1_sym
.ends mux3bit_sym

.model NMOS NMOS
.model PMOS PMOS
.lib standard.mos
.tran 4
.backanno
.end

* Results of the author's LTspice run, read from the files saved beside the schematic
* Operating Point, zero values left out:
*   V(vdd) = 10 V
*   V(a1) = 10 V
*   V(b1) = 10 V
*   V(a2) = 10 V
*   V(b2) = 10 V
*   V(z0) = 100.1 nV
*   V(z1) = 100.1 nV
*   V(z2) = 10 V
*   I(V1) = -2 mA
*   Ix(x1:VPOS) = 2 mA
*   Ix(x1:VNEG) = -2 mA
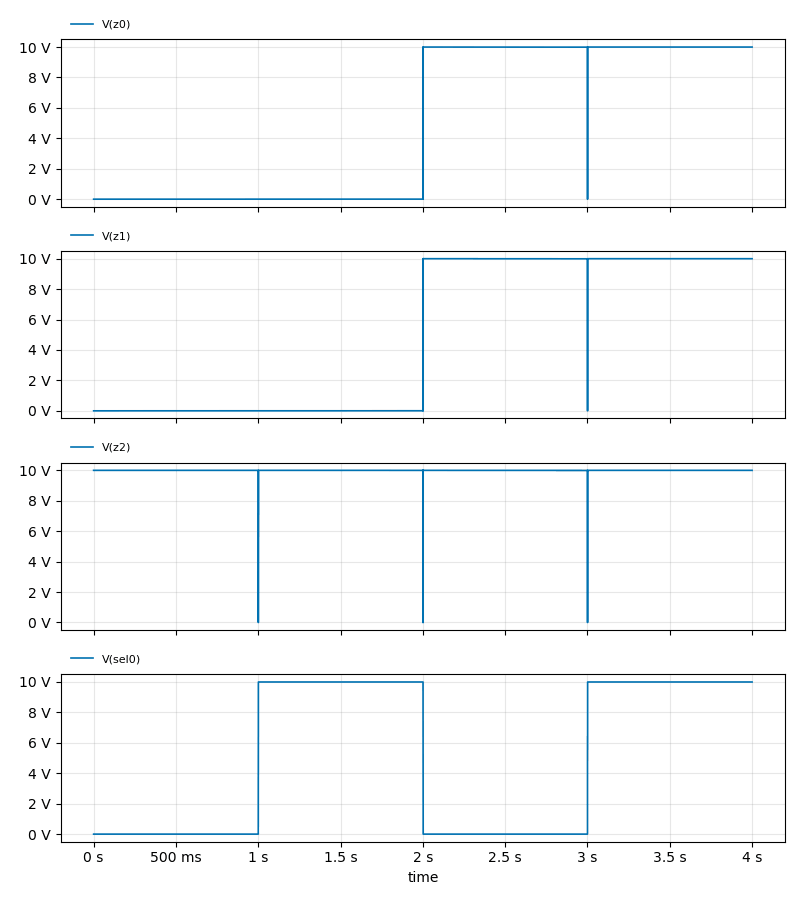
[diagram p8: Transient Analysis of PART_1_SYM_TESTING.asc, plotted from the saved traces]
* Transient Analysis, 1 run:
*   V(z0): min 0 V, max 10 V, average 4.999 V, rms 7.07 V, last 10 V
*   V(z1): min 0 V, max 10 V, average 4.999 V, rms 7.07 V, last 10 V
*   V(z2): min 0 V, max 10 V, average 10 V, rms 10 V, last 10 V
*   V(sel0): min 0 V, max 10 V, average 5.001 V, rms 7.071 V, last 10 V